# Altium project NewGateway.PrjPCB
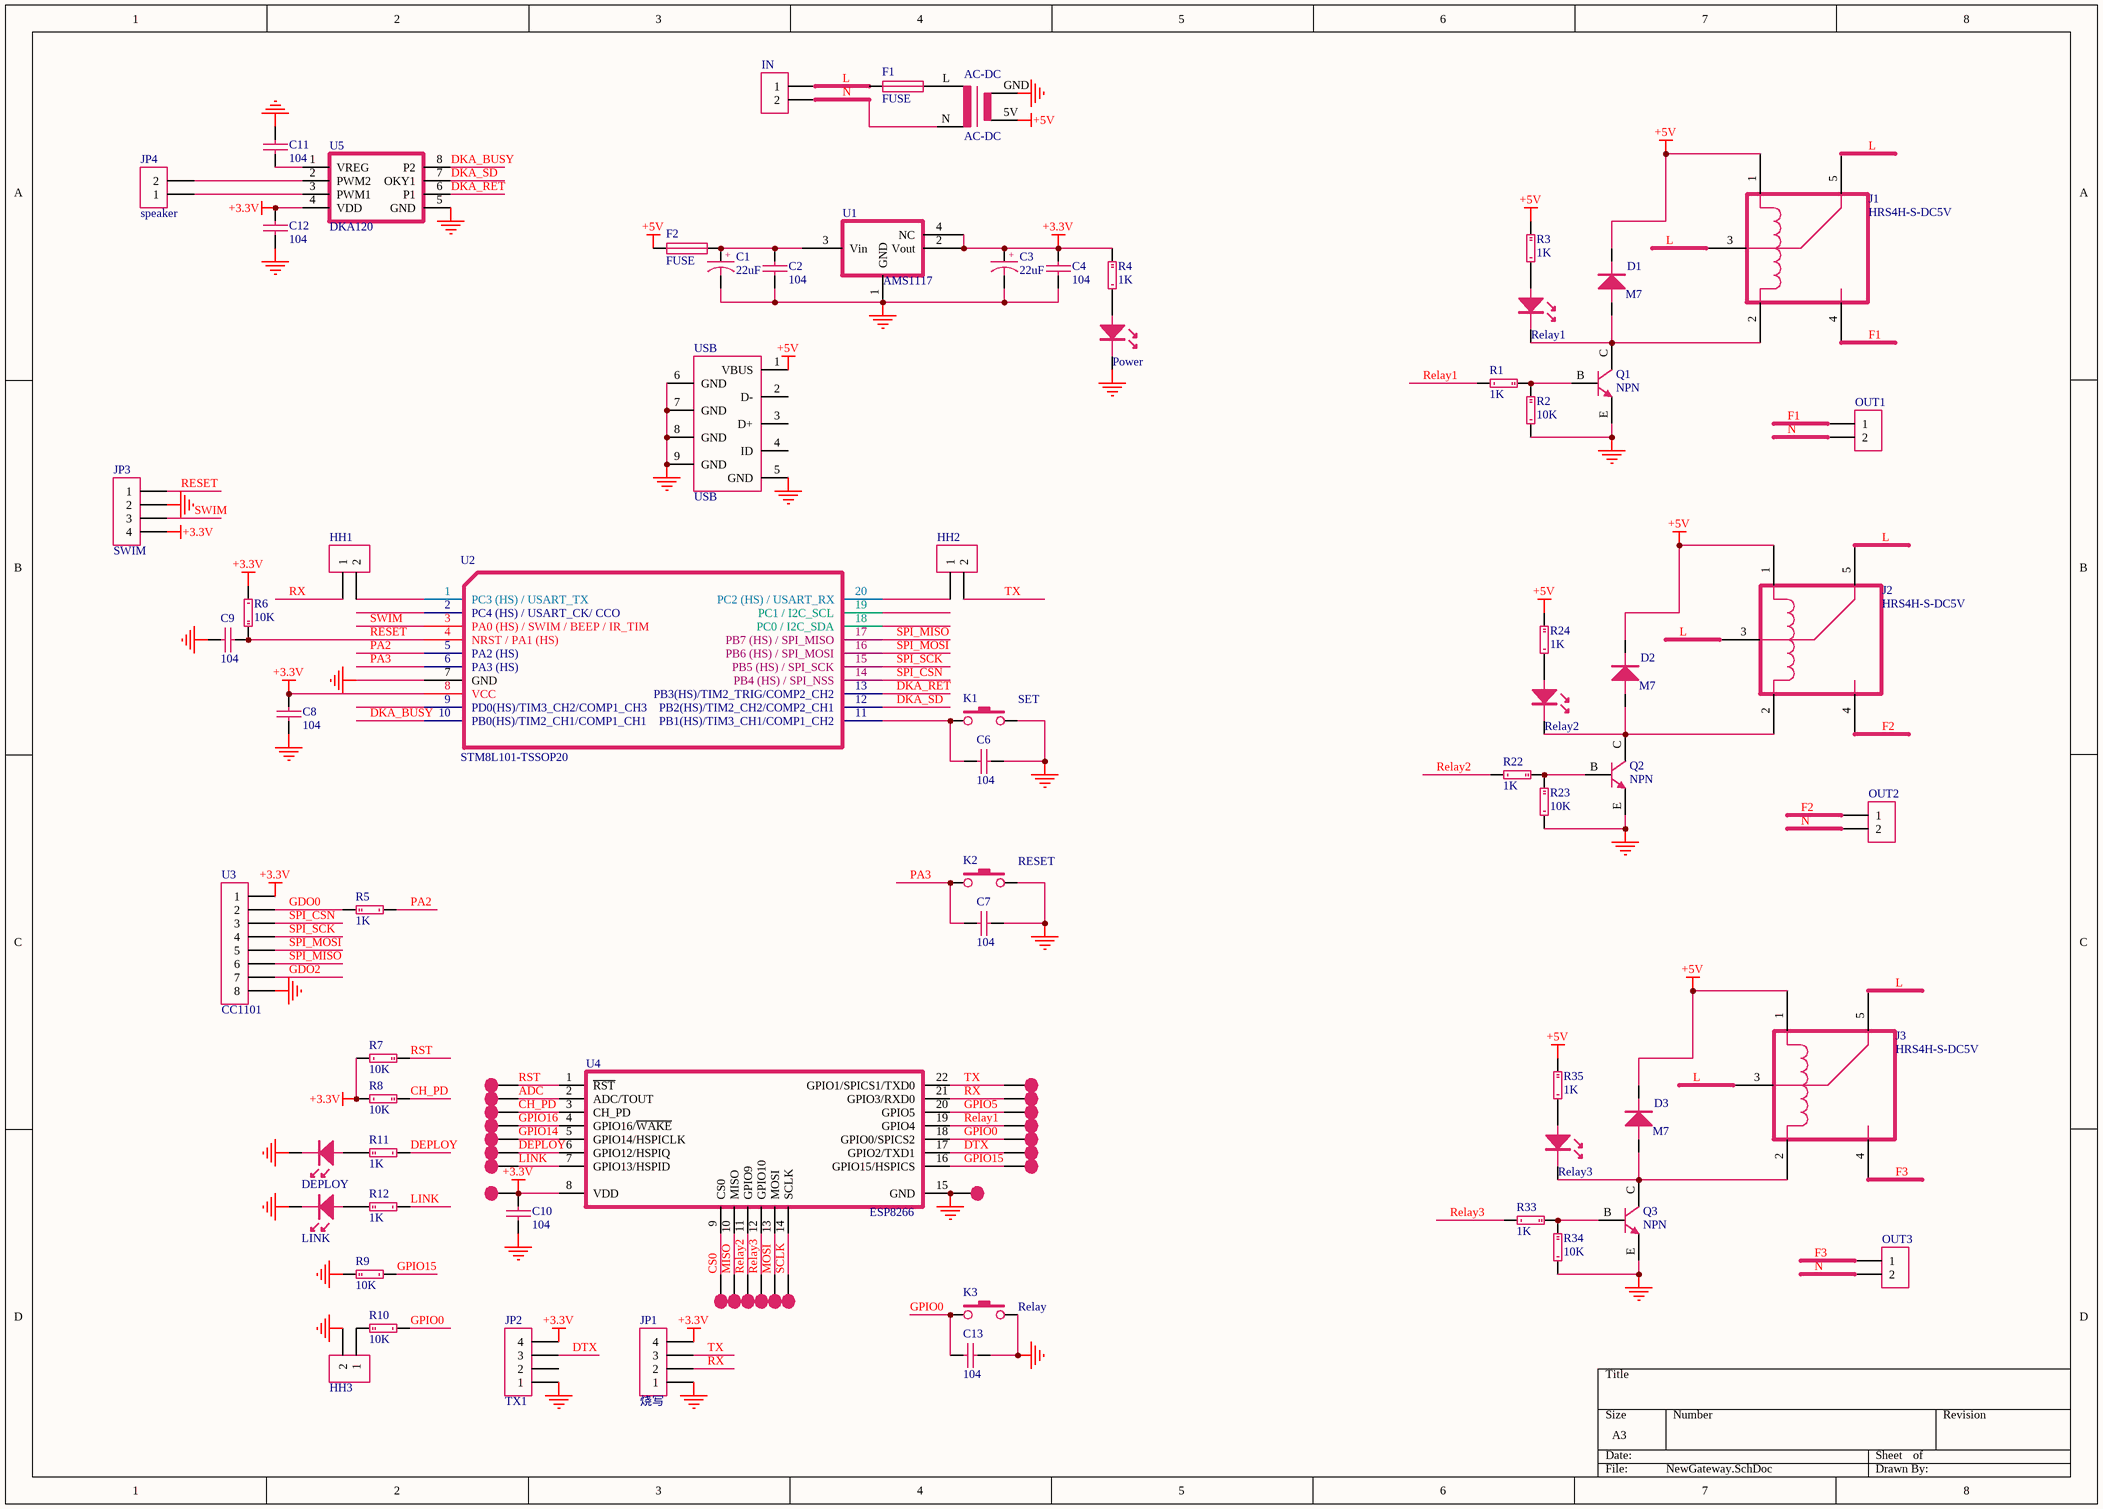
[diagram p0: NewGateway.SchDoc]
1 sheet, 90 parts. Net scope: global (net labels, ports and power ports of the same name join across sheets).
Board file: NewGateway.PcbDoc

## Sheet NewGateway.SchDoc
size A3

### Parts
AC-DC  AC-DC  [AC-DC]
C1  22uF  [C3528]
C2  104  [C0603]
C3  22uF  [C3528]
C4  104  [C0603]
C6  104  [C0603]
C7  104  [C0603]
C8  104  [C0603]
C9  104  [C0603]
C10  104  [C0603]
C11  104  [C0603]
C12  104  [C0603]
C13  104  [C0603]
D1  M7  [DO-214A]
D2  M7  [DO-214A]
D3  M7  [DO-214A]
DEPLOY  LED  [LED0603]  (value not drawn)
F1  FUSE  [Fuse Holder]
F2  FUSE  [F1208]
HH1  (no value)  [SIP2-2.54MM]
HH2  (no value)  [SIP2-2.54MM]
HH3  (no value)  [SIP2-2.54MM]
IN  (no value)  [2EDG_5.08_2P]
J1  HRS4H-S-DC5V  [HRS4H]
J2  HRS4H-S-DC5V  [HRS4H]
J3  HRS4H-S-DC5V  [HRS4H]
JP1  烧写  [SIP4-2.54MM]
JP2  TX1  [SIP4-2.54MM]
JP3  SWIM  [SIP4-2.54MM]
JP4  speaker  [SIP2-1.27MM]
K1  SET  [SW-TACT-4.5MM]
K2  RESET  [SW-TACT-4.5MM]
K3  Relay  [SW-TACT-4.5MM]
LINK  LED  [LED0603]  (value not drawn)
OUT1  (no value)  [2EDG_5.08_2P]
OUT2  (no value)  [2EDG_5.08_2P]
OUT3  (no value)  [2EDG_5.08_2P]
Power  LED  [LED0603]  (value not drawn)
Q1  NPN  [SOT23]
Q2  NPN  [SOT23]
Q3  NPN  [SOT23]
R1  1K  [R0603]
R2  10K  [R0603]
R3  1K  [R0603]
R4  1K  [R0603]
R5  1K  [R0603]
R6  10K  [R0603]
R7  10K  [R0603]
R8  10K  [R0603]
R9  10K  [R0603]
R10  10K  [R0603]
R11  1K  [R0603]
R12  1K  [R0603]
R22  1K  [R0603]
R23  10K  [R0603]
R24  1K  [R0603]
R33  1K  [R0603]
R34  10K  [R0603]
R35  1K  [R0603]
Relay1  LED  [LED0603]  (value not drawn)
Relay2  LED  [LED0603]  (value not drawn)
Relay3  LED  [LED0603]  (value not drawn)
T1  (no value)  [TP]
T2  (no value)  [TP]
T3  (no value)  [TP]
T4  (no value)  [TP]
T5  (no value)  [TP]
T6  (no value)  [TP]
T7  (no value)  [TP]
T8  (no value)  [TP]
T9  (no value)  [TP]
T10  (no value)  [TP]
T11  (no value)  [TP]
T12  (no value)  [TP]
T13  (no value)  [TP]
T14  (no value)  [TP]
T15  (no value)  [TP]
T16  (no value)  [TP]
T17  (no value)  [TP]
T18  (no value)  [TP]
T19  (no value)  [TP]
T20  (no value)  [TP]
T21  (no value)  [TP]
T22  (no value)  [TP]
U1  AMS1117  [SOT223]
U2  STM8L101-TSSOP20  [TSSOP20]
U3  CC1101  [CC1101S]
U4  ESP8266  [ESP-12E]
U5  DKA120  [SOIC8]
USB  USB  [USB-Micro]

### Nets
+3.3V: C3.1 C4.1 C8.2 C10.1 C12.1 JP1.4 JP2.4 JP3.4 R4.2 R6.1 R7.1 R8.1 T15.1 U1.2(Vout) U1.4(NC) U2.8(VCC) U3.1 U4.8(VDD) U5.4(VDD)
+5V: AC-DC.5V D1.2 D2.2 D3.2 F2.1 J1.1 J2.1 J3.1 R3.2 R24.2 R35.2 USB.1(VBUS)
GND: AC-DC.GND C1.2 C2.2 C3.2 C4.2 C6.2 C7.2 C8.1 C9.2 C10.2 C11.1 C12.2 C13.2 DEPLOY.2 HH3.2 JP1.1 JP2.1 JP3.2 K1.2 K2.2 K3.2 LINK.2 Power.2 Q1.E Q2.E Q3.E R2.1 R9.2 R23.1 R34.1 T7.1 U1.1(GND) U2.7(GND) U3.8 U4.15(GND) U5.5(GND) USB.5(GND) USB.6(GND) USB.7(GND) USB.8(GND) USB.9(GND)
ADC: T21.1 U4.2(ADC/TOUT)
CH_PD: R8.2 T20.1 U4.3(CH_PD)
CS0: T1.1 U4.9(CS0)
DEPLOY: R11.1 T17.1 U4.6(GPIO12/HSPIQ)
DKA_BUSY: U2.10(PB0(HS)/TIM2_CH1/COMP1_CH1) U5.8(P2)
DKA_RET: U2.13(PB3(HS)/TIM2_TRIG/COMP2_CH2) U5.6(P1)
DKA_SD: U2.12(PB2(HS)/TIM2_CH2/COMP2_CH1) U5.7(OKY1)
DTX: JP2.3 T9.1 U4.17(GPIO2/TXD1)
F1: J1.4 OUT1.1
F2: J2.4 OUT2.1
F3: J3.4 OUT3.1
GDO0: R5.2 U3.2
GDO2: U3.7
GPIO0: C13.1 K3.1 R10.1 T10.1 U4.18(GPIO0/SPICS2)
GPIO5: T12.1 U4.20(GPIO5)
GPIO14: T18.1 U4.5(GPIO14/HSPICLK)
GPIO15: R9.1 T8.1 U4.16(GPIO15/HSPICS)
GPIO16: T19.1 U4.4(GPIO16/~{WAKE})
L: F1.1 IN.1 J1.3 J1.5 J2.3 J2.5 J3.3 J3.5
LINK: R12.1 T16.1 U4.7(GPIO13/HSPID)
MISO: T2.1 U4.10(MISO)
MOSI: T5.1 U4.13(MOSI)
N: AC-DC.N IN.2 OUT1.2 OUT2.2 OUT3.2
PA2: R5.1 U2.5(PA2_(HS))
PA3: C7.1 K2.1 U2.6(PA3_(HS))
Relay1: R1.1 T11.1 U4.19(GPIO4)
Relay2: R22.1 T3.1 U4.11(GPIO9)
Relay3: R33.1 T4.1 U4.12(GPIO10)
RESET: C9.1 JP3.1 R6.2 U2.4(NRST_/_PA1_(HS))
RST: R7.2 T22.1 U4.1(~{RST})
RX: HH1.1 JP1.2 T13.1 U4.21(GPIO3/RXD0)
SCLK: T6.1 U4.14(SCLK)
SPI_CSN: U2.14(PB4_(HS)_/_SPI_NSS) U3.3
SPI_MISO: U2.17(PB7_(HS)_/_SPI_MISO) U3.6
SPI_MOSI: U2.16(PB6_(HS)_/_SPI_MOSI) U3.5
SPI_SCK: U2.15(PB5_(HS)_/_SPI_SCK) U3.4
SWIM: JP3.3 U2.3(PA0_(HS)_/_SWIM_/_BEEP_/_IR_TIM)
TX: HH2.2 JP1.3 T14.1 U4.22(GPIO1/SPICS1/TXD0)
NetAC-DC_L: AC-DC.L F1.2
NetC1_1: C1.1 C2.1 F2.2 U1.3(Vin)
NetC6_1: C6.1 K1.1 U2.11(PB1(HS)/TIM3_CH1/COMP1_CH2)
NetC11_2: C11.2 U5.1(VREG)
NetD1_1: D1.1 J1.2 Q1.C Relay1.2
NetD2_1: D2.1 J2.2 Q2.C Relay2.2
NetD3_1: D3.1 J3.2 Q3.C Relay3.2
NetDEPLOY_1: DEPLOY.1 R11.2
NetHH1_2: HH1.2 U2.1(PC3_(HS)_/_USART_TX)
NetHH2_1: HH2.1 U2.20(PC2_(HS)_/_USART_RX)
NetHH3_1: HH3.1 R10.2
NetJP4_1: JP4.1 U5.3(PWM1)
NetJP4_2: JP4.2 U5.2(PWM2)
NetLINK_1: LINK.1 R12.2
NetPower_1: Power.1 R4.1
NetQ1_B: Q1.B R1.2 R2.2
NetQ2_B: Q2.B R22.2 R23.2
NetQ3_B: Q3.B R33.2 R34.2
NetR3_1: R3.1 Relay1.1
NetR24_1: R24.1 Relay2.1
NetR35_1: R35.1 Relay3.1

Not connected (* = marked no-connect by the designer): JP2 2; U2 2(PC4_(HS)_/_USART_CK/_CCO) 9(PD0(HS)/TIM3_CH2/COMP1_CH3) 18(PC0_/_I2C_SDA) 19(PC1_/_I2C_SCL); USB 2(D-) 3(D+) 4(ID)

### Notes on the sheet
- (in symbol CAPACITOR) +

### Library data of the parts
AC-DC = AC-DC: 5V700mA(3.5W) 隔离开关电源模块/AC-DC降压模块
C1 C3 = CAPACITOR: 极性电容
C2 C4 C6-C13 = CAP: 无极性电容
D1-D3 = DIODE: 二极管
DEPLOY LINK Power Relay1-Relay3 = LED: LED灯
F1 F2 = FUSE: 保险丝
HH1-HH3 IN JP4 OUT1-OUT3 = HEADER 2X1: 2P接插件
J1-J3 = HRS4H-S-DC5V: HKE汇港继电器
JP1-JP3 = HEADER 4X1: 4P接插件
K1-K3 = SW-PB: 按键
Q1-Q3 = NPN: NPN三极管; Published: *; LatestRevisionDate: *; LatestRevisionNote: *; PackageReference: *; Publisher: *; Code_JEDEC: *
R1-R12 R22-R24 R33-R35 = RES2: 贴片电阻
T1-T22 = TP: 测试点/触摸点
U1 = AMS1117: 稳压芯片(LDO)
U2 = STM8L101-TSSOP20: STM8单片机20引脚
U3 = HEADER 8X1: 8P接插件
U4 = ESP8266-12E: ESP8266贴片模块12E-F
U5 = DKA120: 语音芯片http://www.dk1699.com/
USB = USB: 通用串行总线(USB); 7th Part Field: *; 5th Part Field: *; 4th Part Field: *